# Altium schematic sheet Input Current Sense.SchDoc
size A3
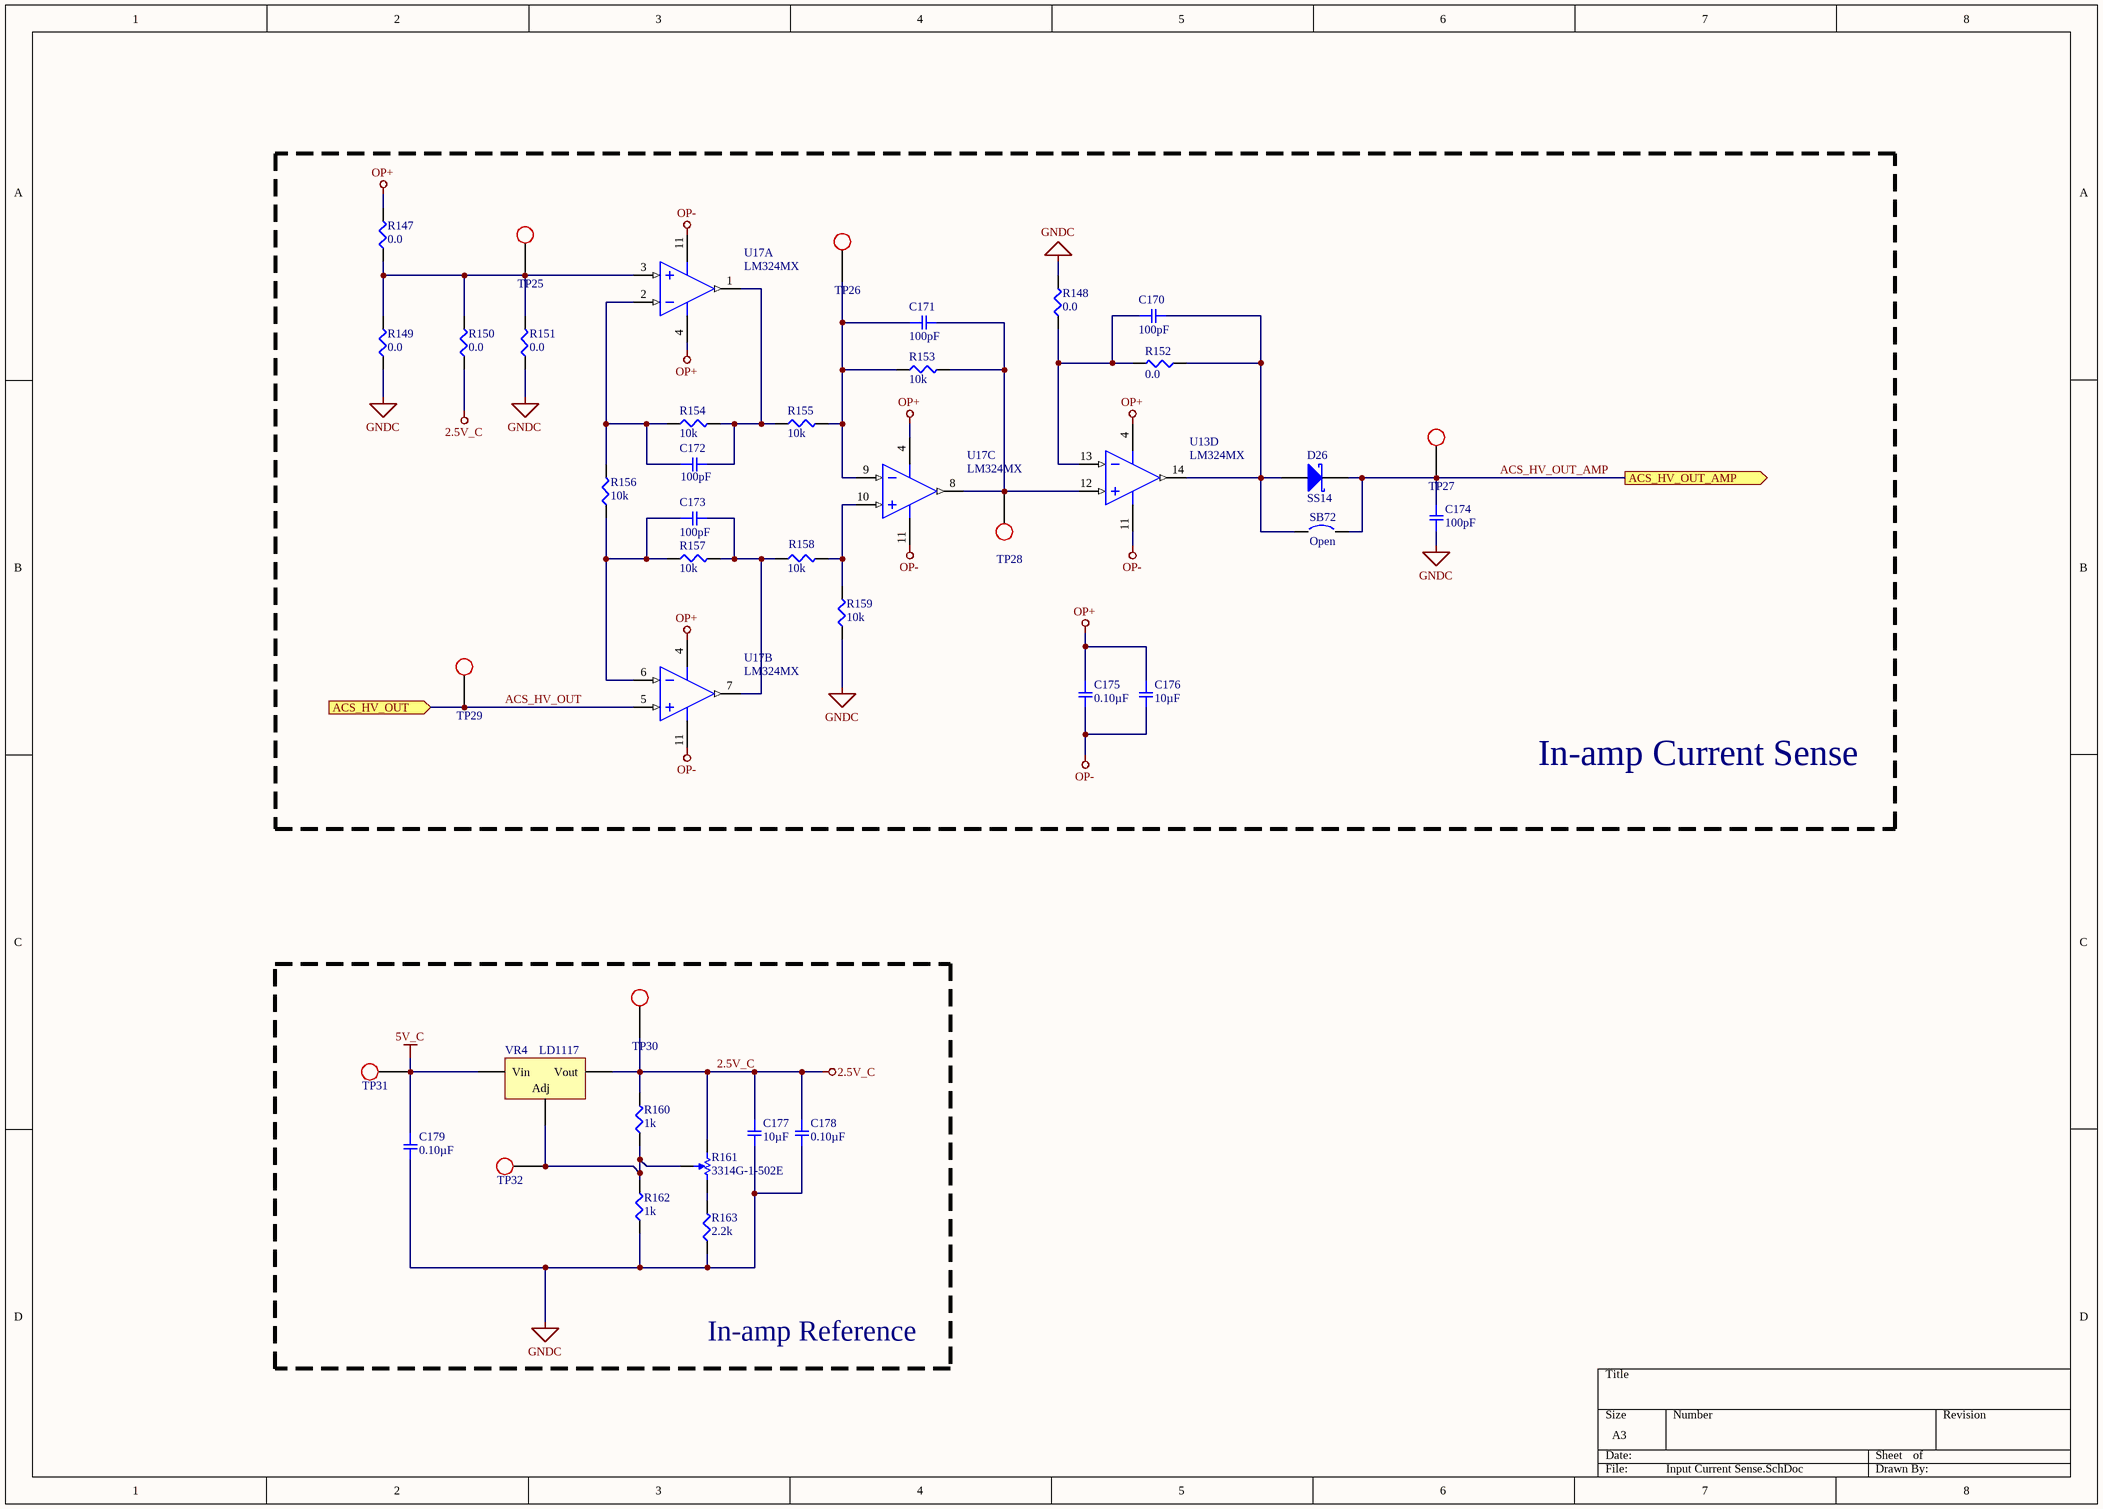
[diagram p0: Input Current Sense.SchDoc]

## Parts
C170  100pF  [SMD-0603C]
C171  100pF  [SMD-0603C]
C172  100pF  [SMD-0603C]
C173  100pF  [SMD-0603C]
C174  100pF  [SMD-0603C]
C175  0.10µF  [SMD-0805C]
C176  10µF  [SMD-0805C]
C177  10µF  [SMD-0805C]
C178  0.10µF  [SMD-0805C]
C179  0.10µF  [SMD-0805C]
D26  SS14  [DIOM4226X22N]
R147  0.0  [SMD-0603-RES]
R148  0.0  [SMD-0603-RES]
R149  0.0  [SMD-0603-RES]
R150  0.0  [SMD-0603-RES]
R151  0.0  [SMD-0603-RES]
R152  0.0  [SMD-0603-RES]
R153  10k  [SMD-0603-RES]
R154  10k  [SMD-0603-RES]
R155  10k  [SMD-0603-RES]
R156  10k  [SMD-0603-RES]
R157  10k  [SMD-0603-RES]
R158  10k  [SMD-0603-RES]
R159  10k  [SMD-0603-RES]
R160  1k  [SMD-0603-RES]
R161  3314G-1-502E  [BOUR-3314G-1_V]
R162  1k  [SMD-0603-RES]
R163  2.2k  [SMD-0603-RES]
SB72  Open  [0805-Solder Bridge]  (no BOM)
TP25  Test Point  [Test_point_THT]  (value not drawn)  (no BOM)
TP26  Test Point  [Test_point_THT]  (value not drawn)  (no BOM)
TP27  Test Point  [Test_point_THT]  (value not drawn)  (no BOM)
TP28  Test Point  [Test_point_THT]  (value not drawn)  (no BOM)
TP29  Test Point  [Test_point_THT]  (value not drawn)  (no BOM)
TP30  Test Point  [Test_point_THT]  (value not drawn)  (no BOM)
TP31  Test Point  [Test_point_THT]  (value not drawn)  (no BOM)
TP32  Test Point  [Test_point_THT]  (value not drawn)  (no BOM)
U13  LM324MX  [D0014A_L]  (part D of 4)
U17  LM324MX  [D0014A_L]  (parts A,B,C of 4)
VR4  LD1117  [SOT230P700X180-4N]

## Blocks framed on the sheet
In-amp Current Sense: C170-C176 D26 R147-R159 SB72 TP25-TP29 U13 U17
In-amp Reference: C177-C179 R160-R163 TP30-TP32 VR4

## Ports
ACS_HV_OUT (in), ACS_HV_OUT_AMP (out)

## Nets
2.5V_C: C177.1 C178.1 R150.1 R160.2 R161.1 TP30.1 VR4.2(Vout)
5V_C: C179.1 TP31.1 VR4.3(Vin)
GNDC: C174.1 C177.2 C178.2 C179.2 R148.2 R149.1 R151.1 R159.1 R162.1 R163.1
OP+: C175.1 C176.1 R147.2 U13.4(V+) U17.4(V+)
OP-: C175.2 C176.2 U13.11(GND) U17.11(GND)
ACS_HV_OUT: TP29.1 U17.5(IN2+) ; port ACS_HV_OUT
ACS_HV_OUT_AMP: C174.2 D26.1(K) SB72.2 TP27.1 ; port ACS_HV_OUT_AMP
NetC170_1: C170.1 R148.1 R152.2 U13.13(IN4-)
NetC170_2: C170.2 D26.2(A) R152.1 SB72.1 U13.14(OUT4)
NetC171_1: C171.1 R153.1 R155.2 TP26.1 U17.9(IN3-)
NetC171_2: C171.2 R153.2 TP28.1 U13.12(IN4+) U17.8(OUT3)
NetC172_1: C172.1 R154.1 R156.2 U17.2(IN1-)
NetC172_2: C172.2 R154.2 R155.1 U17.1(OUT1)
NetC173_1: C173.1 R156.1 R157.1 U17.6(IN2-)
NetC173_2: C173.2 R157.2 R158.1 U17.7(OUT2)
NetR147_1: R147.1 R149.2 R150.2 R151.2 TP25.1 U17.3(IN1+)
NetR158_2: R158.2 R159.2 U17.10(IN3+)
NetR160_1: R160.1 R161.2 R162.2 TP32.1 VR4.1(Adj)
NetR161_3: R161.3 R163.2

## Library data of the parts
C170-C174 = GCM1885C1H101JA16D: CAP CER 100PF 50V NP0 0603; Manufacturer: Murata Electronics North America; Factory Stock: 0; Unit Price (USD): 0.1; Minimum Quantity: 1; Tolerance: ±5%; Temperature Coefficient: C0G, NP0; Datasheets: http://www.murata.com/~/media/webrenewal/support/library/catalog/products/capacitor/mlcc/c03e.ashx; Image: //media.digikey.com/Renders/Murata%20Renders/0603%28GCM188%29.jpg; Digi-Key Part Number: 490-4767-1-ND; Part Number: GCM1885C1H101JA16D; Quantity Available: 85695; @ qty: 0; Packaging: Cut Tape (CT); Series: GCM; Part Status: Active; Value: 100pF; Voltage: 50V; Operating Temperature: -55°C ~ 125°C; Features: -; Ratings: AEC-Q200; Applications: Automotive; Mounting Type: Surface Mount, MLCC; Package / Case: 0603 (1608 Metric); Size / Dimension: 0.063" L x 0.031" W (1.60mm x 0.80mm); Height - Seated (Max): -; Thickness (Max): 0.035" (0.90mm); Lead Spacing: -; Lead Style: -
C175 C178 C179 = GCD21BR71H104KA01L: CAP CER 0.1UF 50V X7R 0805; Manufacturer: Murata Electronics North America; Factory Stock: 0; Unit Price (USD): 0.24; Minimum Quantity: 1; Tolerance: ±10%; Datasheets: http://www.murata.com/~/media/webrenewal/support/library/catalog/products/capacitor/mlcc/c03e.ashx; Image: //media.digikey.com/Renders/Murata%20Renders/0805%28GxM6%29.jpg; Digi-Key Part Number: 490-11955-1-ND; Part Number: GCD21BR71H104KA01L; Quantity Available: 157; @ qty: 0; Packaging: Cut Tape (CT); Series: GCD; Part Status: Active; Value: 0.10µF; Voltage: 50V; Temperature Coefficient: X7R; Operating Temperature: -55°C ~ 125°C; Features: -; Ratings: AEC-Q200; Applications: Automotive; Mounting Type: Surface Mount, MLCC; Package / Case: 0805 (2012 Metric); Size / Dimension: 0.079" L x 0.049" W (2.00mm x 1.25mm); Height - Seated (Max): -; Thickness (Max): 0.049" (1.25mm); Lead Spacing: -; Lead Style: -
C176 C177 = GCJ21BR71A106KE01L: CAP CER 10UF 10V X7R 0805; Manufacturer: Murata Electronics North America; Factory Stock: 0; Unit Price (USD): 0.56; Minimum Quantity: 1; Tolerance: ±10%; Datasheets: http://www.murata.com/~/media/webrenewal/support/library/catalog/products/capacitor/mlcc/c03e.ashx; Image: //media.digikey.com/Renders/Murata%20Renders/0805%20(2012%20Metric)%20.85mm.jpg; Digi-Key Part Number: 490-12646-1-ND; Part Number: GCJ21BR71A106KE01L; Quantity Available: 2702; @ qty: 0; Packaging: Cut Tape (CT); Series: GCJ; Part Status: Active; Value: 10µF; Voltage: 10V; Temperature Coefficient: X7R; Operating Temperature: -55°C ~ 125°C; Features: Soft Termination; Ratings: AEC-Q200; Applications: Automotive, Boardflex Sensitive; Mounting Type: Surface Mount, MLCC; Package / Case: 0805 (2012 Metric); Size / Dimension: 0.079" L x 0.049" W (2.00mm x 1.25mm); Height - Seated (Max): -; Thickness (Max): 0.057" (1.45mm); Lead Spacing: -; Lead Style: -
D26 = SS14: Schottky Rectifier, 1.1 W, -65 to 125 degC, 2-Pin SMD, RoHS, Tape and Reel; Manufacturer: Fairchild; Configuration: SINGLE; Diode Element Material: SILICON; Power Dissipation Limit-Max (W): 1.1; Additional Feature: FREEWHEELINGDIODE; Signal Diode Type: SIGNALDIODE; Number of Elements: 1; JEDEC-95 Code: DO-214AC; Rep Pk Reverse Voltage-Max (V): 40; Package Body Material: PLASTIC/EPOXY; CAGE Code: 1HBD3,07933,59621,7D893; Peak Reflow Temperature (Cel): 260; Package Shape: RECTANGULAR; Manufacturer URL: https://www.fairchildsemi.com/; JESD-97 Code: e3; Package Reference: DO-214AC-2; RoHS Compliant: YES; Package Description: 2-Pin Surface Mount Device, Body 4.375 x 2.725 mm; Technology: SCHOTTKY; Surface Mount: YES; Datasheet URL: http://www.onlinecomponents.com/datasheet/ss14.aspx?p=11369800; Terminal Form: CBEND; Package Style: SMALLOUTLINE; Number of Terminals: 2; JESD-30 Code: R-PDSO-C2; Average Forward Current-Max (A): 1; Terminal Finish: MATTETIN; Datasheet Version: Oct-13; Terminal Position: DUAL; Package URL: https://www.fairchildsemi.com/package-drawings/DO/DO214AC.pdf; Moisture Sensitivity Level: 1; Lead Free: YES
R147-R152 = ERJ-3GEY0R00V: RES SMD 0.0OHM JUMPER 1/10W 0603; Manufacturer: Panasonic Electronic Components; Factory Stock: 0; Unit Price (USD): 0.00352; @ qty: 1500; Minimum Quantity: 1; Power (Watts): 0.1W, 1/10W; Part Number: ERJ-3GEY0R00V; Datasheets: http://industrial.panasonic.com/www-cgi/jvcr13pz.cgi?E+PZ+3+AOA0001+ERJ3GEY0R00V+7+WW; Image: //media.digikey.com/Photos/Panasonic%20Photos/MFG_ERJ-P6W%20Series.jpg; Digi-Key Part Number: P0.0GCT-ND; Quantity Available: 4813372; Packaging: Cut Tape (CT); Series: ERJ; Part Status: Active; Value: 0.0; Tolerance: Jumper; Composition: Thick Film; Features: Automotive AEC-Q200; Temperature Coefficient: -; Operating Temperature: -55°C ~ 155°C; Package / Case: 0603 (1608 Metric); Supplier Device Package: 0603; Size / Dimension: 0.063" L x 0.031" W (1.60mm x 0.80mm); Height - Seated (Max): 0.022" (0.55mm); Number of Terminations: 2; Failure Rate: -
R153-R159 = ERJ-3EKF1002V: RES SMD 10K OHM 1% 1/10W 0603; Manufacturer: Panasonic Electronic Components; Factory Stock: 0; Unit Price (USD): 0.00379; @ qty: 1500; Minimum Quantity: 1; Power (Watts): 0.1W, 1/10W; Temperature Coefficient: ±100ppm/°C; Part Number: ERJ-3EKF1002V; Datasheets: http://industrial.panasonic.com/www-cgi/jvcr13pz.cgi?E+PZ+3+AOA0002+ERJ3EKF1002V+7+WW; Image: //media.digikey.com/Photos/Panasonic%20Photos/MFG_ERJ-P6W%20Series.jpg; Digi-Key Part Number: P10.0KHCT-ND; Quantity Available: 6703141; Packaging: Cut Tape (CT); Series: ERJ; Part Status: Active; Value: 10k; Tolerance: ±1%; Composition: Thick Film; Features: Automotive AEC-Q200; Operating Temperature: -55°C ~ 155°C; Package / Case: 0603 (1608 Metric); Supplier Device Package: 0603; Size / Dimension: 0.063" L x 0.031" W (1.60mm x 0.80mm); Height - Seated (Max): 0.022" (0.55mm); Number of Terminations: 2; Failure Rate: -
R160 R162 = ERJ-3EKF1001V: RES SMD 1K OHM 1% 1/10W 0603; Manufacturer: Panasonic Electronic Components; Factory Stock: 0; Unit Price (USD): 0.00379; @ qty: 1500; Minimum Quantity: 1; Power (Watts): 0.1W, 1/10W; Temperature Coefficient: ±100ppm/°C; Part Number: ERJ-3EKF1001V; Datasheets: http://industrial.panasonic.com/www-cgi/jvcr13pz.cgi?E+PZ+3+AOA0002+ERJ3EKF1001V+7+WW; Image: //media.digikey.com/Photos/Panasonic%20Photos/MFG_ERJ-P6W%20Series.jpg; Digi-Key Part Number: P1.00KHCT-ND; Quantity Available: 5218845; Packaging: Cut Tape (CT); Series: ERJ; Part Status: Active; Value: 1k; Tolerance: ±1%; Composition: Thick Film; Features: Automotive AEC-Q200; Operating Temperature: -55°C ~ 155°C; Package / Case: 0603 (1608 Metric); Supplier Device Package: 0603; Size / Dimension: 0.063" L x 0.031" W (1.60mm x 0.80mm); Height - Seated (Max): 0.022" (0.55mm); Number of Terminations: 2; Failure Rate: -
R161 = CMP-2000-05589-1: 4 mm Square Trimpot(R) Trimming Potentiometer, 5 KOhm, +/- 20%, 0.25 W, -55 to 125 degC, 3-Pin SMD, RoHS, Tape and Reel; Manufacturer: Bourns; Power: 250; Angle of rotation: 240°; Dielectric strength: 500; Resistance: 5; Curve: linear; Package Description: 3-Pin Surface Mount Device, Body 4.5 x 4.5 mm, Pitch 1.15 mm; Package Reference: 3314G-1; Mounting Technology: SurfaceMount; Datasheet URL: http://www.bourns.com/docs/Product-Datasheets/3314.pdf; Datasheet Version: 05/2016; Tolerance: ±20%; Manufacturer URL: http://www.bourns.com/; Temperature range: -55...+125°C; Package: GullWing
R163 = ERJ-3EKF2201V: RES SMD 2.2K OHM 1% 1/10W 0603; Manufacturer: Panasonic Electronic Components; Factory Stock: 0; Unit Price (USD): 0.00379; @ qty: 1500; Minimum Quantity: 1; Power (Watts): 0.1W, 1/10W; Temperature Coefficient: ±100ppm/°C; Part Number: ERJ-3EKF2201V; Datasheets: http://industrial.panasonic.com/www-cgi/jvcr13pz.cgi?E+PZ+3+AOA0002+ERJ3EKF2201V+7+WW; Image: //media.digikey.com/Photos/Panasonic%20Photos/MFG_ERJ-P6W%20Series.jpg; Digi-Key Part Number: P2.20KHCT-ND; Quantity Available: 370956; Packaging: Cut Tape (CT); Series: ERJ; Part Status: Active; Value: 2.2k; Tolerance: ±1%; Composition: Thick Film; Features: Automotive AEC-Q200; Operating Temperature: -55°C ~ 155°C; Package / Case: 0603 (1608 Metric); Supplier Device Package: 0603; Size / Dimension: 0.063" L x 0.031" W (1.60mm x 0.80mm); Height - Seated (Max): 0.022" (0.55mm); Number of Terminations: 2; Failure Rate: -
SB72 = Solder Bridge: Circuit Breaker; Published: 24-Mar-1999; Revision: July-2002: Re-released for DXP Platform.; Publisher: Altium Limited
TP25-TP32 = Test Point: TP
U13 U17 = CMP-0055-00741-3: Low Power Quad Operational Amplifier, 14-pin Narrow SOIC; Manufacturer: Texas Instruments; PowerWise: N; CompType: Amplifiers; PackageTopMarking: NSUZXYTTE#*LM324M; Package Reference: D0014A; ComponentLink1URL: http://www.ti.com/general/docs/lit/getliterature.tsp?genericPartNumber=LM324-N&fileType=pdf; PinCount: 14; PackageDescription: Molded Package S.O., .150in Wide, 14 Lead; Code_JEDEC: MS-012AB; Code_IPC: SOIC127P600-14; ComponentLink1Description: Datasheet URL; RoHS: N
VR4 = LD117-Adj: Voltage Regulator; Published: 24-Mar-1999; LatestRevisionDate: 29-May-2009; LatestRevisionNote: IPC-7351 Footprint Added.; PackageReference: D2PAK; Publisher: Altium Limited; PackageDescription: 3-Pin Transistor Outline Package 2.54 mm Pitch, 15.1 mm Lead Span